# EAGLE design PSX_DC_HID (EAGLE 9.6.2)
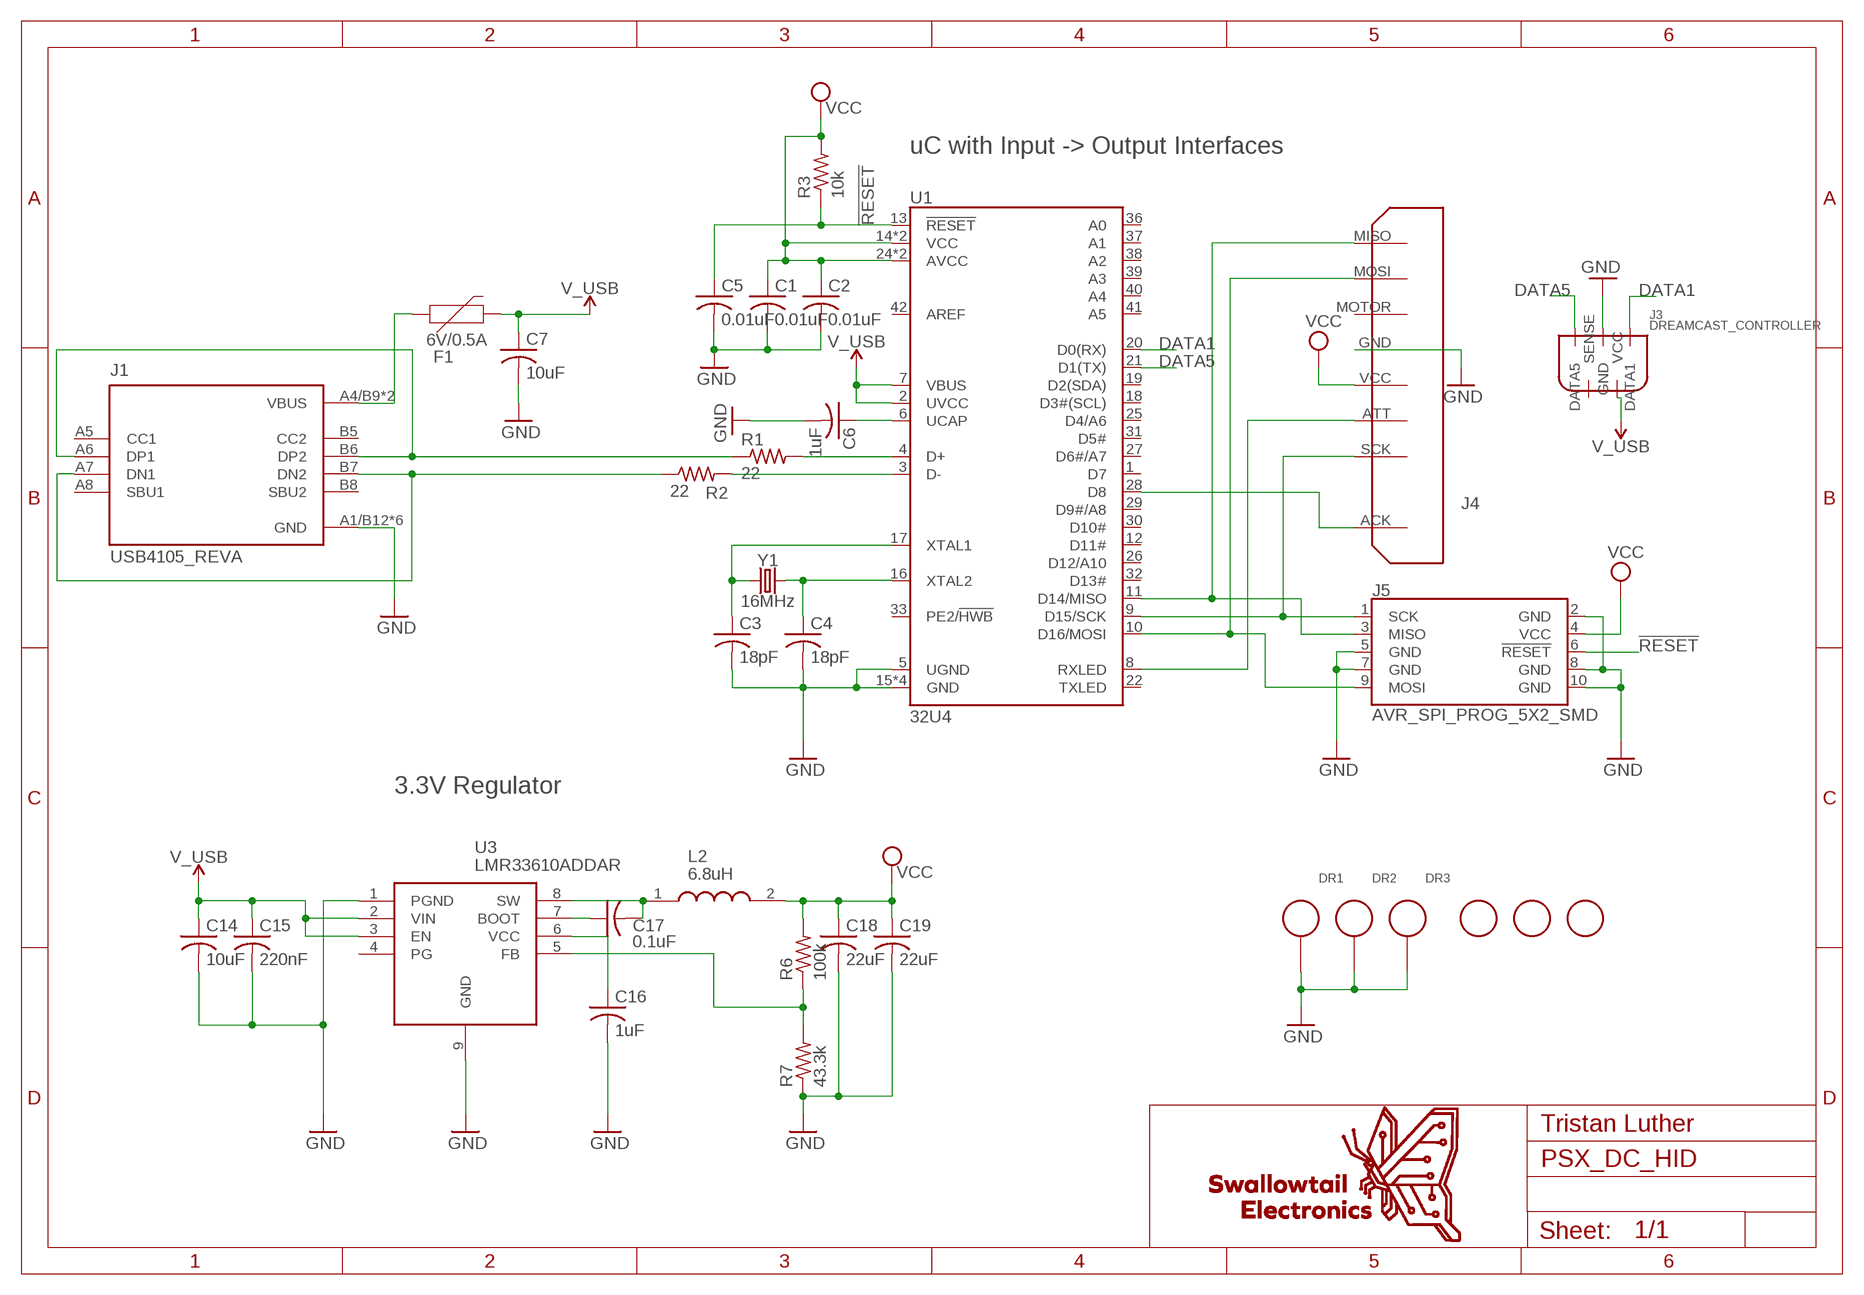
[diagram p0: schematic, sheet 1]

## Parts
C1  0.01uF  C-USC0805  [C0805]
C2  0.01uF  C-USC0805  [C0805]
C3  18pF  C-USC0805  [C0805]
C4  18pF  C-USC0805  [C0805]
C5  0.01uF  C-USC0805  [C0805]
C6  1uF  C-USC0805  [C0805]
C7  10uF  C-USC0805  [C0805]
C14  10uF  C-USC0805  [C0805]
C15  220nF  C-USC0805  [C0805]
C16  1uF  C-USC0805  [C0805]
C17  0.1uF  C-USC0805  [C0805]
C18  22uF  C-USC0805  [C0805]
C19  22uF  C-USC0805  [C0805]
DR1  3MM_DRILL_GND  [3MM_DRILL_GND]
DR2  3MM_DRILL_GND  [3MM_DRILL_GND]
DR3  3MM_DRILL_GND  [3MM_DRILL_GND]
F1  6V/0.5A  PPTC_HALF-AMP  [1206]
J1  USB4105_REVA  [GCT_USB4105_REVA]
J3  DREAMCAST_CONTROLLER  [1_05X2MM]
J4  PSX_CONTROLLERPSX_HORIZONTAL  [PSX_HORIZONTAL]
J5  AVR_SPI_PROG_5X2_SMD  [SAMTECH_FTSH-105-01]
L2  6.8uH  SRP5015TA-2R2M  [INDPM5752X150N]
R1  22  R-US_R0805  [R0805]
R2  22  R-US_R0805  [R0805]
R3  10k  R-US_R0805  [R0805]
R6  100k  R-US_R0805  [R0805]
R7  43.3k  R-US_R0805  [R0805]
U1  32U4  ATMEGA32U4-ARDUINOTQFP-44  [TQFP44]
U3  LMR33610ADDAR  [SOIC127P600X170-9N]
U$2  FIDUCIAL  [FIDUCIAL_1MM]
U$3  FIDUCIAL  [FIDUCIAL_1MM]
U$4  FIDUCIAL  [FIDUCIAL_1MM]
Y1  16MHz  CRYSTAL-16MHZSMD-5X3.2  [CRYSTAL-SMD-5X3.2-4PAD]

## Nets
!RESET: C5.1 J5.6(!RESET) R3.1 U1.13(!RESET)
DATA1: J3.1(DATA1) U1.20(D0(RX))
DATA5: J3.2(DATA5) U1.21(D1(TX))
GND: C1.2 C2.2 C3.2 C4.2 C5.2 C6.2 C7.2 C14.2 C15.2 C16.2 C18.2 C19.2 DR1.DR(D$1) DR2.DR(D$1) DR3.DR(D$1) J1.A1/B12(GND) J1.B1/A12(GND) J1.G1(GND) J1.G2(GND) J1.G3(GND) J1.G4(GND) J3.3(GND) J4.GND J5.2(GND) J5.5(GND) J5.7(GND) J5.8(GND) J5.10(GND) R7.1 U1.5(UGND) U1.15(GND) U1.23(GND) U1.35(GND) U1.43(GND) U3.1(PGND) U3.9(GND)
N$1: C4.1 U1.16(XTAL2) Y1.3
N$2: C3.1 U1.17(XTAL1) Y1.1
N$3: R2.2 U1.3(D-)
N$4: R1.2 U1.4(D+)
N$6: J1.A7(DN1) J1.B7(DN2) R2.1
N$7: J4.MISO J5.3(MISO) U1.11(D14/MISO)
N$8: J4.SCK J5.1(SCK) U1.9(D15/SCK)
N$9: J4.MOSI J5.9(MOSI) U1.10(D16/MOSI)
N$10: C6.1 U1.6(UCAP)
N$11: J4.ATT U1.8(RXLED)
N$12: J1.A6(DP1) J1.B6(DP2) R1.1
N$13: J4.ACK U1.28(D8)
N$14: F1.1 J1.A4/B9(VBUS) J1.B4/A9(VBUS)
N$18: R6.1 R7.2 U3.5(FB)
N$19: C17.2 L2.1 U3.8(SW)
N$20: C17.1 U3.7(BOOT)
N$21: C16.1 U3.6(VCC)
V_USB: C7.1 C14.1 C15.1 F1.2 J3.5(VCC) U1.2(UVCC) U1.7(VBUS) U3.2(VIN) U3.3(EN)
VCC: C1.1 C2.1 C18.1 C19.1 J4.VCC J5.4(VCC) L2.2 R3.2 R6.2 U1.14(VCC) U1.24(AVCC) U1.34(VCC) U1.44(AVCC)
Unconnected: J1.A5(CC1) J1.A8(SBU1) J1.B5(CC2) J1.B8(SBU2) J3.4(SENSE) J4.MOTOR U1.1(D7) U1.12(D11#) U1.18(D3#(SCL)) U1.19(D2(SDA)) U1.22(TXLED) U1.25(D4/A6) U1.26(D12/A10) U1.27(D6#/A7) U1.29(D9#/A8) U1.30(D10#) U1.31(D5#) U1.32(D13#) U1.33(PE2/!HWB) U1.36(A0) U1.37(A1) U1.38(A2) U1.39(A3) U1.40(A4) U1.41(A5) U1.42(AREF) U3.4(PG)

## Notes on the sheet
- uC with Input -> Output Interfaces
- 3.3V Regulator

## Library data of the parts
C1-C7 = MyLibrary:C-US: CAPACITOR, American symbol
C14-C19 = Swallowtail_Passives:C-US: CAPACITOR, American symbol
DR1-DR3 = MyLibrary:3MM_DRILL_GND: Common 3mm Machine Screw Hole. Better than your standard drill! Connects to the ground of the circuit board to the enclosure.
F1 = Swallowtail_PowerManagment:PPTC: Resettable Fuse PPTC Resettable Fuse. Really a sort of resistor with a polymeric positive temperature coefficient whose resistance increases dramatically with an increase in temperature. When heated by the power passing through the resistance rises causing the current to be limited, protecting the circuit. This is achieved by the transition of the polymer from a crystalline to an amorphous state where the conductive carbon separates breaking the conductive pathways found in the cool crystalline structure. When a PPTC cools back down it resumes conducting letting the circuit turn back on. SparkFun Products: SparkFun RedBoard - Programmed with Arduino <https://www.sparkfun.com/products/12757> Pro Micro - 5V/16MHz <https://www.sparkfun.com/products/12640> Arduino Pro 328 - 5V/16MHz <https://www.sparkfun.com/products/10915> MP3 Trigger <https://www.sparkfun.com/products/13720>; PROD_ID: RES-08585
J1 = Swallowtail_Connectors:USB4105_REVA: USB Type C Receptacle for USB 2.0 SMT Type, PCB Top Mount; DESCRIPTION: USB-C (USB TYPE-C) USB 2.0 Receptacle Connector 24 (16+8 Dummy) Position Surface Mount, Right Angle; Through Hole; DIGI-KEY_PART_NUMBER: 2073-USB4105-GF-ACT-ND; MF: Global Connector Technology; MP: USB4105; PACKAGE: Package
J3 = MyLibrary:DREAMCAST_CONTROLLER
J4 = Swallowtail_Connectors:PSX_CONTROLLER
J5 = Swallowtail_Connectors:AVR_SPI_PROG_5X2: Cortex Debug Connector - 10 pin Supports JTAG debug, Serial Wire debug, and Serial Wire Viewer. PTH and SMD connector options available. General Connector Information <http://infocenter.arm.com/help/topic/com.arm.doc.faqs/attached/13634/cortex_debug_connectors.pdf> Products: PTH Connector <http://www.digikey.com/product-detail/en/cnc-tech/3220-10-0100-00/1175-1627-ND/3883661> -via Digi-Key SparkFun PSoc <https://www.sparkfun.com/products/13229> SparkFun T <https://www.sparkfun.com/products/13810>
L2 = Swallowtail_Passives:SRP5015TA-2R2M: Bourns SRP5015TA Series Shielded Wire-wound SMD Inductor with a Carbonyl Powder Core, 2.2 H Wire-Wound 4A Idc Q:10 Source: Datasheet <https://www.bourns.com/docs/Product-Datasheets/SRP5015TA.pdf>; ARROW_PART_NUMBER: SRP5015TA-2R2M; ARROW_PRICE-STOCK: https://www.arrow.com/en/products/srp5015ta-2r2m/bourns; DESCRIPTION: Bourns SRP5015TA Series Shielded Wire-wound SMD Inductor with a Carbonyl Powder Core, 2.2 H Wire-Wound 4A Idc Q:10; HEIGHT: 1.5mm; MANUFACTURER_NAME: Bourns; MANUFACTURER_PART_NUMBER: SRP5015TA-2R2M; MOUSER_PART_NUMBER: 652-SRP5015TA-2R2M; MOUSER_PRICE-STOCK: https://www.mouser.co.uk/ProductDetail/Bourns/SRP5015TA-2R2M?qs=ZwKJWZfDtNjiXC2UrFyYsA%3D%3D
R1-R3 = MyLibrary:R-US_: RESISTOR, American symbol
R6 R7 = Swallowtail_Passives:R-US_: RESISTOR, American symbol
U1 = Swallowtail_Microcontroller:ATMEGA32U4-ARDUINO: Atmel MCU, 32KByte Atmel 44-pin 8-bit Microcontroller with 32KBytes of ISP Flash and USB Controller Datasheet <http://cdn.sparkfun.com/datasheets/Dev/Arduino/Boards/ATMega32U4.pdf> SparkFun Products LilyPad Arduino USB - ATmega32U4 Board <https://www.sparkfun.com/products/12049> (DEV-12049) Pro Micro - 5V/16MHz <https://www.sparkfun.com/products/12640> (DEV-12640) Pro Micro - 3.3V/8MHz <https://www.sparkfun.com/products/12587> (DEV-12587) Fio v3 - ATmega32U4 <https://www.sparkfun.com/products/11520> (DEV-11520) Qduino Mini <https://www.sparkfun.com/products/13614> (DEV-13614) Makey Makey - Standard Kit <https://www.sparkfun.com/products/11511> (WIG-11511) Makey Makey Deluxe Kit <https://www.sparkfun.com/products/11519> (WIG-11519); PROD_ID: IC-11161
U3 = Swallowtail_PowerManagment:LMR33610ADDAR: SIMPLE SWITCHER 3.8V to 36V, 3A Synchronous Buck Converter With Ultra-Low EMI Source: Datasheet <http://www.ti.com/lit/gpn/lmr33630>; ARROW_PART_NUMBER: LMR33630ADDAR; ARROW_PRICE-STOCK: https://www.arrow.com/en/products/lmr33630addar/texas-instruments; DESCRIPTION: SIMPLE SWITCHER 3.8V to 36V, 3A Synchronous Buck Converter With Ultra-Low EMI; HEIGHT: 1.7mm; MANUFACTURER_NAME: Texas Instruments; MANUFACTURER_PART_NUMBER: LMR33630ADDAR; MOUSER_PART_NUMBER: 595-LMR33630ADDAR; MOUSER_PRICE-STOCK: https://www.mouser.co.uk/ProductDetail/Texas-Instruments/LMR33630ADDAR?qs=r5DSvlrkXmJQkBTqgVdiDA%3D%3D
U$2-U$4 = Swallowtail_ManufactingTest:FIDUCIAL: For use by pick and place machines to calibrate the vision/machine, 1mm By microbuilder.eu
Y1 = MyLibrary:CRYSTAL-16MHZ: 16MHz Crystal Digikey Example <http://www.digikey.com/product-search/en?keywords=535-9122-1-ND> Frequency: 16MHz Frequency Stability: ±50ppm Frequency Tolerance: ±20ppm Load Capacitance: 18pF SparkFun Products: Pro Micro -5V/16MHz <https://www.sparkfun.com/products/12640> SparkFun Serial Enabled LCD Kit <https://www.sparkfun.com/products/10097>; PROD_ID: XTAL-08218; SF_ID: COM-00094

## Board
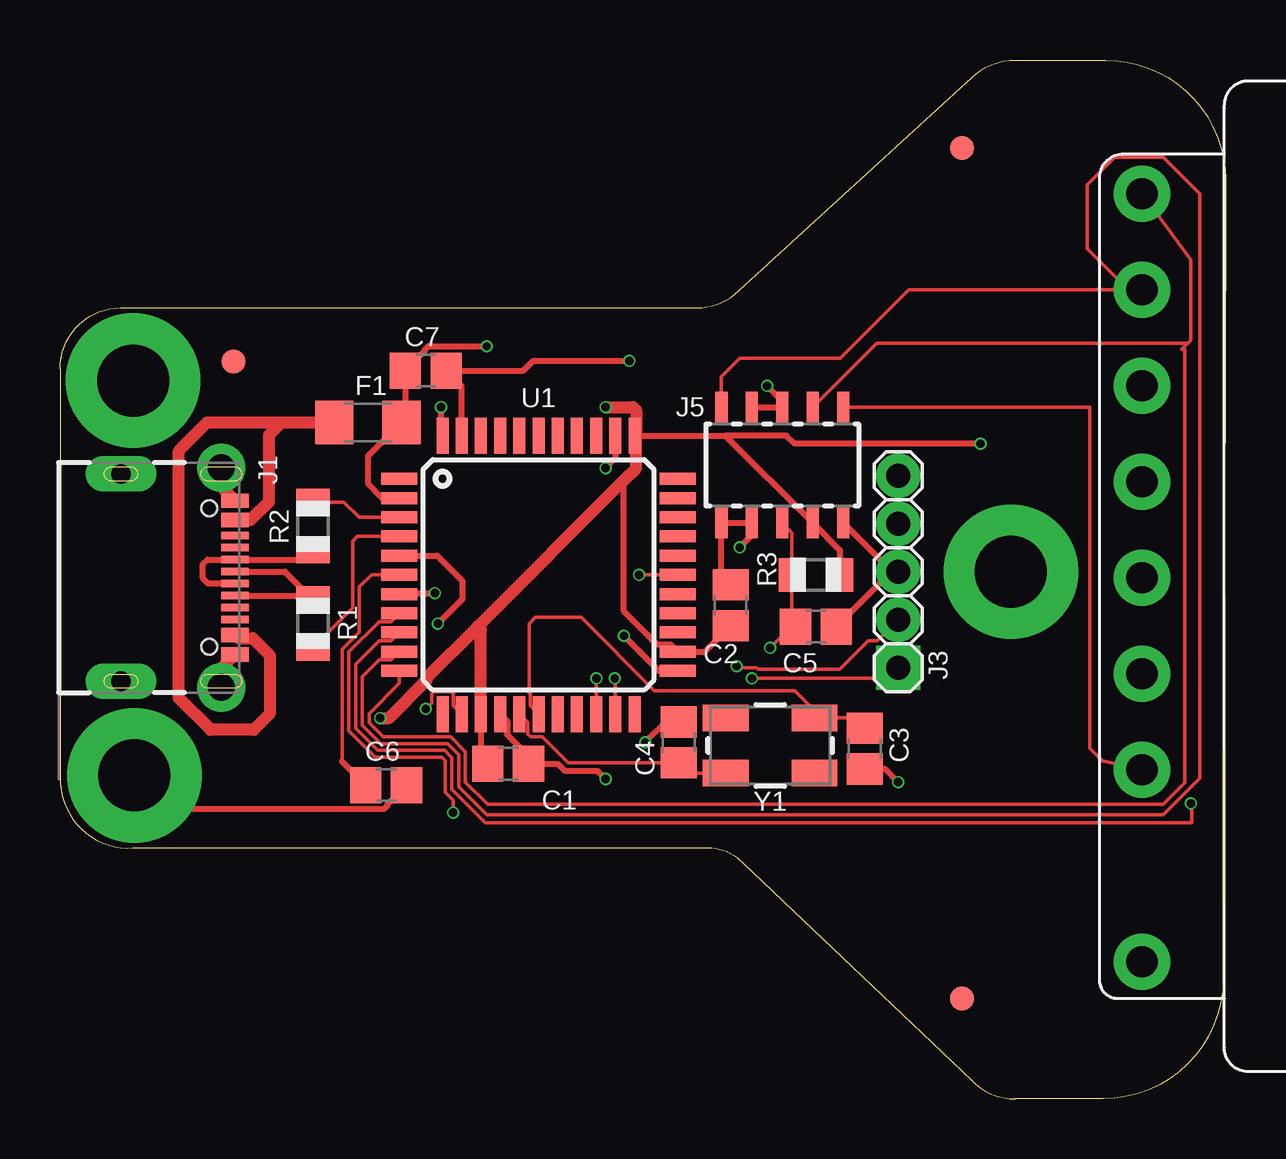
[diagram p1: board, top side]
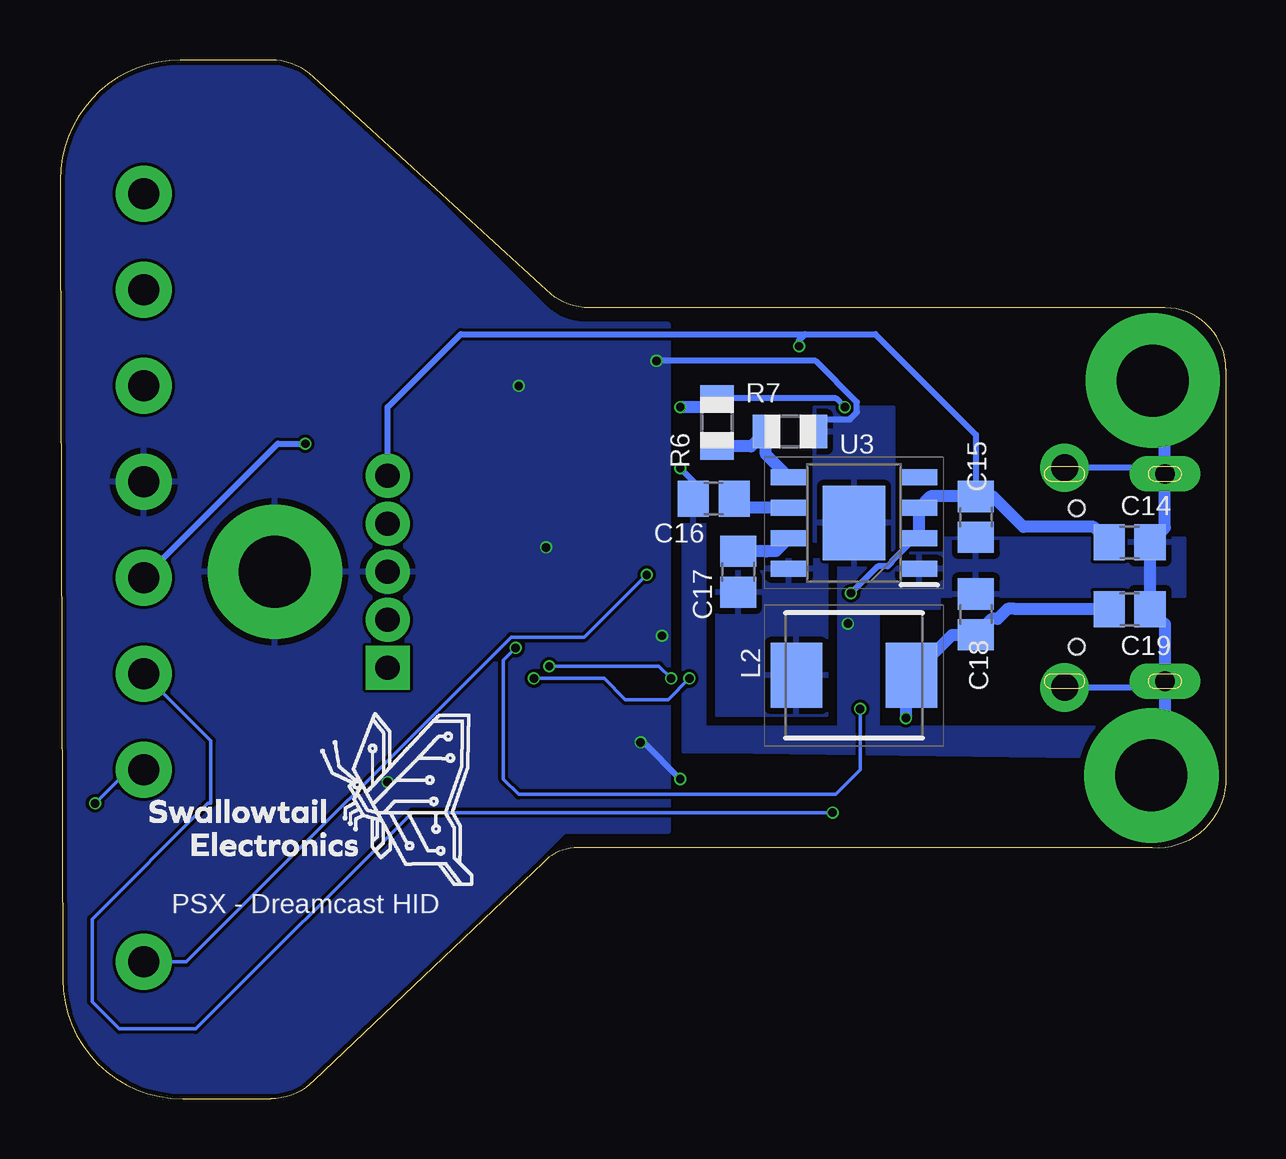
[diagram p2: board, bottom side, seen from below]

Size 48.58 x 43.28 mm. Coordinates in mm from the lower left corner, seen from the top.
Outline: 0,30.42 0.01,13.12 arc90 3.06,10.45 27.15,10.45 arc-45 28.44,9.83 38,0.75 arc45 39.8,0 43.47,0 arc90 48.47,4.98 48.58,36.88 48.56,36.89 48.56,38.28 arc90 43.56,43.28 39.79,43.28 arc44 38.01,42.55 28.3,33.68 arc-44 26.52,32.96 2.54,32.96 arc90 0,30.42
Copper layers (1*16): Top 0.035mm / dielectric 1.6mm / Bottom 0.035mm
Design rules "jlcpcb-eagle": minimum track width 5mil, minimum drill 0.3mm, track to track 5mil, track to pad 5mil, pad to pad 5mil, via to via 5mil, smd to smd 5mil, copper to edge 0.2mm, drill to drill 6mil, minimum pad ring 10mil, minimum via ring 3mil, stop-mask expansion 4mil, vias tented up to drill 0mil, thermal gap 10mil

### Footprints (pad centres in the part's own frame; a part is rotated, then mirrored left to right if it is on the bottom)
C0805 = smd 1.3 x 1.5: 1 -0.85,0; 2 0.85,0
3MM_DRILL_GND = drill 3 pad 5.6: DR 0,0.127
1206 = smd 1.6 x 1.8: 1 -1.4,0; 2 1.4,0
GCT_USB4105_REVA = smd 0.6 x 1.15: A1/B12 -3.2,4.755; A4/B9 -2.4,4.755; B1/A12 3.2,4.755; B4/A9 2.4,4.755 | smd 0.3 x 1.15: A5 -1.25,4.755; A6 -0.25,4.755; A7 0.25,4.755; A8 1.25,4.755; B5 1.75,4.755; B6 0.75,4.755; B7 -0.75,4.755; B8 -1.75,4.755 | drill 0.82 pad 1.27 long: G1 -4.32,0; G2 4.32,0 | drill 1.12: G3 -4.574,4.18; G4 4.574,4.18 | hole 0.65: 2.89,3.68; -2.89,3.68
1_05X2MM = drill 1.016 pad 1.3 square: 1 -4,0 | drill 1.016 pad 1.3: 2 -2,0; 3 0,0; 4 2,0; 5 4,0
PSX_HORIZONTAL = drill 1.3 pad 2.2: ACK -16,0; ATT -4,0; GND 4,0; MISO 16,0; MOSI 12,0; MOTOR 8,0; SCK -8,0; VCC 0,0
SAMTECH_FTSH-105-01 = smd 0.508 x 1.27: 1 -2.54,-2.413; 2 -2.54,2.413; 3 -1.27,-2.413; 4 -1.27,2.413; 5 0,-2.413; 6 0,2.413; 7 1.27,-2.413; 8 1.27,2.413; 9 2.54,-2.413; 10 2.54,2.413
INDPM5752X150N = smd 2.15 x 2.7: 1 -2.4,0; 2 2.4,0
R0805 = smd 1.1 x 1.4: 1 -1,0; 2 1,0
TQFP44 = smd 1.5 x 0.5: 1 -5.8,4; 2 -5.8,3.2; 3 -5.8,2.4; 4 -5.8,1.6; 5 -5.8,0.8; 6 -5.8,0; 7 -5.8,-0.8; 8 -5.8,-1.6; 9 -5.8,-2.4; 10 -5.8,-3.2; 11 -5.8,-4; 23 5.8,-4; 24 5.8,-3.2; 25 5.8,-2.4; 26 5.8,-1.6; 27 5.8,-0.8; 28 5.8,0; 29 5.8,0.8; 30 5.8,1.6; 31 5.8,2.4; 32 5.8,3.2; 33 5.8,4 | smd 0.5 x 1.5: 12 -4,-5.8; 13 -3.2,-5.8; 14 -2.4,-5.8; 15 -1.6,-5.8; 16 -0.8,-5.8; 17 0,-5.8; 18 0.8,-5.8; 19 1.6,-5.8; 20 2.4,-5.8; 21 3.2,-5.8; 22 4,-5.8; 34 4,5.8; 35 3.2,5.8; 36 2.4,5.8; 37 1.6,5.8; 38 0.8,5.8; 39 0,5.8; 40 -0.8,5.8; 41 -1.6,5.8; 42 -2.4,5.8; 43 -3.2,5.8; 44 -4,5.8
SOIC127P600X170-9N = smd 1.525 x 0.65: 1 -2.712,1.905; 2 -2.712,0.635; 3 -2.712,-0.635; 4 -2.712,-1.905; 5 2.712,-1.905; 6 2.712,-0.635; 7 2.712,0.635; 8 2.712,1.905 | smd 2.6 x 3.1: 9 0,0
FIDUCIAL_1MM = smd 1 x 1: 1 0,0
CRYSTAL-SMD-5X3.2-4PAD = smd 1.9 x 1.1: 1 -1.85,-1.15; 2 1.85,-1.15; 3 1.85,1.15; 4 -1.85,1.15

### Placement (x,y rotation side)
C1  18.67,13.96 0 top
C2  27.94,20.56 90 top
C3  33.53,14.59 270 top
C4  25.78,14.85 90 top
C5  31.5,19.67 0 top
C6  13.59,13.07 0 top
C7  15.24,30.34 0 top
C14  4.01,23.18 0 bottom
C15  10.41,24.24 270 bottom
C16  21.34,25.01 180 bottom
C17  20.32,21.96 270 bottom
C18  10.41,20.18 90 bottom
C19  4.01,20.4 0 bottom
DR1  3.1,13.35 0 top
DR2  3.05,29.79 0 top
DR3  39.75,21.96 90 top
F1  12.83,28.18 0 top
J1  2.54,21.72 270 top
J3  34.92,21.96 90 top
J4  45.09,21.7 90 top
J5  30.1,26.4 180 top
L2  15.49,17.64 0 bottom
R1  10.54,19.8 270 top
R2  10.54,23.86 90 top
R3  31.5,21.83 0 top
R6  21.21,28.18 90 bottom
R7  18.16,27.8 180 bottom
U1  19.94,21.83 0 top
U3  15.49,23.99 180 bottom
U$2  37.59,4.18 90 top
U$3  7.24,30.72 90 top
U$4  37.59,39.61 90 top
U$5  [SWALLOWTAIL_LOGO_SMALL]  44.83,8.88 0 bottom
Y1  29.59,14.72 180 top

### Tracks (layer width: path | path; a pad name or v marks a point on that pad's centre or on a via)
!RESET  (via drill 0.35)
  Top 0.152: J5.6 30.5,23.59 R3.1 30.5,19.82 C5.1 30.48,19.67 v29.59,18.78 | v15.24,16.24 15.49,16.49 15.49,16.87 15.61,16.98 16.27,16.98 16.39,16.87 16.39,16.38 U1.13
  Bottom 0.152: v15.24,16.24 15.24,13.7 16.26,12.69 29.46,12.69 30.1,13.32 30.1,18.28 v29.59,18.78
DATA1  (via drill 0.35)
  Top 0.152: v28.83,17.51 34.48,17.51 J3.1 | v22.35,17.51 22.35,16.04 U1.20
  Bottom 0.152: v28.83,17.51 25.91,17.51 25.02,16.62 23.24,16.62 v22.35,17.51
DATA5  (via drill 0.35)
  Top 0.152: J3.2 34.04,19.08 33.67,19.08 32.49,17.89 29.09,17.89 29.02,17.97 28.25,17.97 v28.19,18.02 | v23.11,17.51 23.14,17.49 U1.21
  Bottom 0.152: v28.19,18.02 23.62,18.02 v23.11,17.51
GND  (via drill 0.35)
  Top 0.254: v24.38,14.85 25.23,15.7 C4.2 | U1.15 18.64,15.74 18.64,15.18 19.52,14.29 C1.2 20.75,13.96 21.04,13.67 22.39,13.67 v22.73,13.32 | U1.43 16.74,29.69 C7.2 19.3,30.34 19.71,30.75 v23.72,30.75 | C5.2 34.63,21.96 J3.3 34.67,21.96 J5.2 | C2.2 27.56,21.79 J5.10 J5.8 28.83,23.48 v28.32,22.97 | J5.7 J5.5 30.1,29.07 v29.46,29.71 | U1.35 23.14,26.68 v22.73,26.28 | C6.2 13.64,12.27 13.64,12.21 13.49,12.06 4.72,12.06 3.31,13.47 DR1.DR | C3.2 34.38,13.74 v34.92,13.2 | U1.23 24.95,17.83 v23.5,19.29 | U1.5 15.71,22.63 16.76,21.58 16.76,20.82 v15.75,19.8
  Top 0.508: J1.A1/B12 6.72,25.49 J1.G3 | J1.B1/A12 6.72,17.94 J1.G4
  Bottom 0.254: C16.2 22.19,25.73 v22.73,26.28 | J1.G4 2.87,17.14 2.54,17.48 | J1.G1 2.79,26.29 J1.G3 | v22.73,13.32 24.26,14.85 v24.38,14.85 | v23.72,30.75 17.09,30.75 15.37,29.03 15.37,28.61 15.67,28.31 16.65,28.31 R7.1
  Bottom 0.508: DR2.DR 2.54,29.41 J1.G1 2.54,23.8 C14.2 C19.2 2.54,19.77 2.54,17.48 J1.G2 2.54,14.03 DR1.DR
  pour Bottom: 1.71,23.36 11.68,23.36 11.68,22.72 13.84,22.72 13.84,28.82 17.14,28.82 17.14,23.23 16.13,23.23 16.13,15.48 21.21,15.48 21.21,14.47 2.92,14.21 2.92,14.47 2.92,15.48 14.48,15.48 14.48,20.43 11.94,20.43 11.94,20.94 1.71,20.94
  pour Bottom: 21.72,25.51 21.72,15.48 21.21,15.48 21.21,14.47 22.61,14.47 22.61,25.51
  pour Bottom: 23.24,11.16 23.24,32.25 26.63,32.25 arc45 28.43,32.99 37.99,42.55 arc-45 39.79,43.29 43.51,43.29 arc-90 48.51,38.29 48.51,4.99 arc-90 43.51,-0.01 39.79,-0.01 arc-45 37.99,0.73 27.56,11.16
N$1
  Top 0.152: Y1.3 26.21,13.57 C4.1 21.17,14 20.09,15.08 19.61,15.08 19.49,15.2 19.49,15.68 U1.16
N$2
  Top 0.152: C3.1 33.1,15.87 Y1.1 31.44,16.17 30.61,17.01 24.77,17.01 21.72,20.05 19.81,20.05 19.56,19.8 19.56,16.9 19.59,16.87 19.59,16.38 U1.17
N$3
  Top 0.152: R2.2 11.83,24.86 12.46,24.23 U1.3
N$4
  Top 0.152: R1.2 12.19,20.45 12.19,23.23 12.39,23.43 U1.4
N$6
  Top 0.254: R2.1 10.14,22.47 J1.B7 6.15,22.47 5.96,22.28 5.96,21.68 6.17,21.47 J1.A7
N$7
  Top 0.152: J5.3 34.04,31.48 46.99,31.48 | 46.99,31.48 46.74,31.23 46.86,31.23 46.86,13.16 45.97,12.27 17.82,12.27 16.89,13.2 16.89,14.47 16.28,15.08 13.47,15.08 12.88,15.67 12.88,16.05 14.14,17.31 U1.11 | 46.99,31.48 47.12,31.61 47.12,34.96 J4.MISO
N$8  (via drill 0.35)
  Top 0.152: J5.1 42.91,28.82 42.91,14.61 43.43,14.08 J4.SCK | U1.9 13.79,19.08 13.3,19.08 12.32,18.1 12.32,15.44 13.24,14.52 16.02,14.52 16.33,14.21 16.33,12.89 17.73,11.49 47.16,11.49 47.16,12.27 v47.12,12.31
  Bottom 0.152: J4.SCK 45.34,14.08 v47.12,12.31
N$9
  Top 0.152: J5.9 27.56,30.09 28.32,30.85 32.51,30.85 35.37,33.7 J4.MOSI 44.52,33.7 42.8,35.42 42.8,38.09 43.94,39.23 45.97,39.23 47.5,37.71 47.5,13.36 45.98,11.84 17.78,11.84 16.61,13 16.61,14.34 16.15,14.8 13.36,14.8 12.6,15.56 12.6,17.58 13.3,18.28 13.79,18.28 U1.10
N$10
  Top 0.152: U1.6 12.98,21.83 12.47,21.32 12.47,19.45 11.76,18.74 11.76,14.05
  Top 0.254: 11.76,14.05 C6.1
N$11  (via drill 0.35)
  Top 0.152: U1.8 13.79,19.88 13.3,19.88 12.04,18.62 12.04,15.33 13.12,14.24 15.9,14.24 16.05,14.08 16.05,12.77 16.38,12.44 v16.38,11.93
  Bottom 0.152: v16.38,11.93 33.91,11.93 42.93,2.91 46.1,2.91 47.24,4.05 47.24,7.48 42.42,12.31 42.29,12.31 42.29,14.91 J4.ATT
N$12
  Top 0.254: J1.A6 9.37,21.97 R1.1 10.37,20.97 J1.B6
N$13  (via drill 0.35)
  Top 0.152: U1.28 v24.13,21.83
  Bottom 0.152: v24.13,21.83 26.72,19.24 29.78,19.24 43.31,5.7 J4.ACK
N$14
  Top 0.508: J1.A4/B9 7.94,24.12 8.71,24.89 8.71,27.66 9.23,28.18 | 9.23,28.18 F1.1 | J1.B4/A9 7.41,19.2 8.03,19.2 8.74,18.49 8.74,16.04 8.06,15.37 6.27,15.37 4.95,16.69 4.95,27 6.13,28.18 9.23,28.18
N$18
  Bottom 0.508: U3.5 19.16,26.85 R7.2 19.78,27.18 R6.1
N$19
  pour Bottom: 16.64,22.47 19.18,22.47 19.18,21.96 21.21,21.96 21.21,15.99 16.64,15.99
N$20
  Bottom 0.508: U3.7 18.75,22.82 19.14,22.82 19.14,22.81 C17.1
N$21
  Bottom 0.508: U3.6 20.11,24.63 C16.1
V_USB  (via drill 0.35)
  Top 0.254: U1.2 13.44,25.03 12.83,25.64 12.83,26.78 F1.2 14.39,28.34 C7.1 15.19,31.14 15.19,31.2 15.35,31.36 v17.78,31.36 | U1.7 14.18,21.07 v15.62,21.07
  Bottom 0.254: J3.5 34.92,28.82 31.88,31.86 17.53,31.86 | 17.53,31.86 14.61,31.86 10.41,27.67 C15.1 | 17.53,31.86 17.78,31.61 v17.78,31.36 | v15.62,21.07 14.5,22.19 14.09,22.19 13.94,22.34 13.94,22.37 12.96,23.36 U3.2
  Bottom 0.508: U3.2 U3.3 12.31,25.09 C15.1 9.7,25.09 8.44,23.83 5.51,23.83 C14.1
VCC  (via drill 0.35)
  Top 0.254: U1.14 17.54,14.24 C1.1 | U1.44 15.88,27.7 v15.88,28.82 | U1.34 27.73,27.63 | 27.73,27.63 J5.4 32.5,22.86 R3.2 | v38.35,27.29 30.61,27.29 30.27,27.63 27.73,27.63 | C2.1 26.86,18.63 U1.24 25.44,18.93 24.88,18.93 23.5,20.32 23.5,25.77
  Top 0.508: 17.4,19.67 15.27,17.54 15.27,17.42 13.71,15.86 v13.34,15.86 | 17.4,19.67 23.5,25.77 24,26.28 24,27.57 | 24,27.57 U1.34 | v22.73,28.82 23.88,28.82 24,28.69 24,27.57 | U1.14 17.54,19.53 17.4,19.67
  Bottom 0.254: v15.88,28.82 16.24,29.18 R6.2 | J4.VCC 39.5,27.29 v38.35,27.29
  Bottom 0.508: R6.2 21.57,28.82 v22.73,28.82 | v13.34,15.86 13.34,17.4 L2.2 11.4,19.33 C18.1 9.74,20 9.51,20 9.1,20.41 8.79,20.41 8.78,20.4 C19.1

### Text on the board
bPlace: PSX - Dreamcast HID